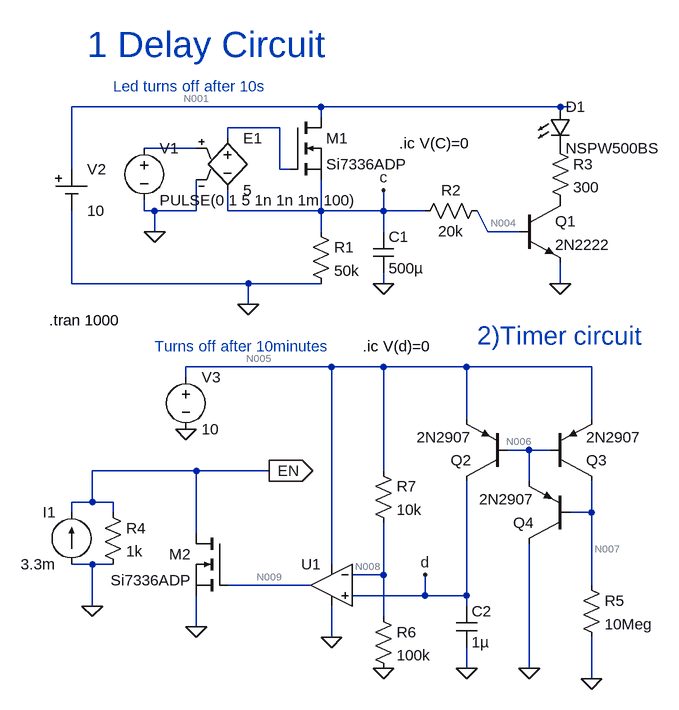
[diagram p0: schematic TimerDelay.asc]
TimerDelay.asc, the LTspice schematic file:
Version 4
SHEET 1 1604 680
WIRE 1072 -432 688 -432
WIRE 1440 -432 1072 -432
WIRE 1456 -432 1440 -432
WIRE 1072 -416 1072 -432
WIRE 1008 -400 928 -400
WIRE 928 -384 928 -400
WIRE 880 -368 800 -368
WIRE 688 -336 688 -432
WIRE 1008 -336 1008 -400
WIRE 1024 -336 1008 -336
WIRE 800 -272 800 -288
WIRE 816 -272 800 -272
WIRE 880 -272 880 -320
WIRE 880 -272 816 -272
WIRE 928 -272 928 -304
WIRE 1072 -272 1072 -320
WIRE 1072 -272 928 -272
WIRE 1168 -272 1168 -304
WIRE 1168 -272 1072 -272
WIRE 1232 -272 1168 -272
WIRE 816 -240 816 -272
WIRE 1072 -240 1072 -272
WIRE 1168 -240 1168 -272
WIRE 1328 -240 1312 -272
WIRE 1376 -240 1328 -240
WIRE 688 -160 688 -272
WIRE 960 -160 688 -160
WIRE 1072 -160 960 -160
WIRE 1168 -160 1168 -176
WIRE 1440 -160 1440 -192
WIRE 960 -128 960 -160
WIRE 1088 -32 864 -32
WIRE 1168 -32 1088 -32
WIRE 1296 -32 1168 -32
WIRE 1488 -32 1296 -32
WIRE 864 -16 864 -32
WIRE 1296 48 1296 -32
WIRE 1488 48 1488 -32
WIRE 1392 96 1360 96
WIRE 1424 96 1392 96
WIRE 880 128 720 128
WIRE 992 128 880 128
WIRE 1168 128 1168 -32
WIRE 1392 144 1392 96
WIRE 720 176 720 128
WIRE 720 176 688 176
WIRE 752 176 720 176
WIRE 688 192 688 176
WIRE 752 192 752 176
WIRE 1488 192 1488 144
WIRE 1488 192 1456 192
WIRE 880 224 880 128
WIRE 720 272 688 272
WIRE 752 272 720 272
WIRE 1088 272 1088 -32
WIRE 1168 288 1168 208
WIRE 1168 288 1120 288
WIRE 1056 304 928 304
WIRE 1488 304 1488 192
WIRE 1232 320 1232 288
WIRE 1232 320 1120 320
WIRE 1296 320 1296 144
WIRE 1296 320 1232 320
WIRE 720 336 720 272
WIRE 1296 336 1296 320
WIRE 1168 352 1168 288
WIRE 880 368 880 320
WIRE 1088 384 1088 336
WIRE 1296 432 1296 400
WIRE 1392 432 1392 240
WIRE 1488 448 1488 384
FLAG 960 -128 0
FLAG 1168 -160 0
FLAG 1440 -160 0
FLAG 816 -240 0
FLAG 1168 -304 c
FLAG 992 128 EN
IOPIN 992 128 Out
FLAG 880 368 0
FLAG 720 336 0
FLAG 864 64 0
FLAG 1088 384 0
FLAG 1488 448 0
FLAG 1296 432 0
FLAG 1168 432 0
FLAG 1232 288 d
FLAG 1392 432 0
SYMBOL nmos 1024 -416 R0
SYMATTR InstName M1
SYMATTR Value Si7336ADP
SYMBOL e 928 -400 R0
SYMATTR InstName E1
SYMATTR Value 5
SYMBOL voltage 800 -384 R0
WINDOW 123 0 0 Left 0
WINDOW 39 0 0 Left 0
SYMATTR InstName V1
SYMATTR Value PULSE(0 1 5 1n 1n 1m 100)
SYMBOL Misc\\cell 688 -336 R0
SYMATTR InstName V2
SYMATTR Value 10
SYMBOL res 1056 -256 R0
SYMATTR InstName R1
SYMATTR Value 50k
SYMBOL cap 1152 -240 R0
SYMATTR InstName C1
SYMATTR Value 500µ
SYMBOL res 1328 -288 R90
WINDOW 0 0 56 VBottom 2
WINDOW 3 32 56 VTop 2
SYMATTR InstName R2
SYMATTR Value 20k
SYMBOL npn 1376 -288 R0
SYMATTR InstName Q1
SYMATTR Value 2N2222
SYMBOL LED 1424 -432 R0
SYMATTR InstName D1
SYMATTR Value NSPW500BS
SYMATTR Description Diode
SYMATTR Type diode
SYMBOL res 1424 -384 R0
SYMATTR InstName R3
SYMATTR Value 300
SYMBOL nmos 928 224 M0
SYMATTR InstName M2
SYMATTR Value Si7336ADP
SYMBOL current 688 272 R180
WINDOW 0 24 80 Left 2
WINDOW 3 24 0 Left 2
SYMATTR InstName I1
SYMATTR Value 3.3m
SYMBOL res 736 176 R0
SYMATTR InstName R4
SYMATTR Value 1k
SYMBOL voltage 864 -32 R0
SYMATTR InstName V3
SYMATTR Value 10
SYMBOL OpAmps\\UniversalOpamp2 1088 304 M0
SYMATTR InstName U1
SYMBOL cap 1280 336 R0
SYMATTR InstName C2
SYMATTR Value 1µ
SYMBOL res 1472 288 R0
SYMATTR InstName R5
SYMATTR Value 10Meg
SYMBOL pnp 1360 144 R180
SYMATTR InstName Q2
SYMATTR Value 2N2907
SYMBOL pnp 1424 144 M180
SYMATTR InstName Q3
SYMATTR Value 2N2907
SYMBOL res 1152 336 R0
SYMATTR InstName R6
SYMATTR Value 100k
SYMBOL res 1152 112 R0
SYMATTR InstName R7
SYMATTR Value 10k
SYMBOL pnp 1456 240 R180
SYMATTR InstName Q4
SYMATTR Value 2N2907
TEXT 712 -528 Left 5 ;1 Delay Circuit
TEXT 752 -464 Left 2 ;Led turns off after 10s
TEXT 654 -104 Left 2 !.tran 1000
TEXT 1192 -376 Left 2 !.ic V(C)=0
TEXT 1136 -64 Left 2 !.ic V(d)=0
TEXT 816 -64 Left 2 ;Turns off after 10minutes
TEXT 1312 -80 Left 4 ;2)Timer circuit

The netlist it stands for:
* TimerDelay.asc
M1 N001 N002 c c Si7336ADP
E1 N002 c N003 0 5
V1 N003 0 PULSE(0 1 5 1n 1n 1m 100)
V2 N001 0 10
R1 c 0 50k
C1 c 0 500µ
R2 N004 c 20k
Q1 P001 N004 0 0 2N2222
D1 N001 P002 NSPW500BS
R3 P002 P001 300
M2 EN N009 0 0 Si7336ADP
I1 0 EN 3.3m
R4 EN 0 1k
V3 N005 0 10
XU1 d N008 N005 0 N009 level.2 Avol=1Meg GBW=10Meg Slew=10Meg ilimit=25m rail=0 Vos=0 phimargin=45 en=0 enk=0 in=0 ink=0 Rin=500Meg  ; pins IN+ IN- V+ V- OUT
C2 d 0 1µ
R5 N007 0 10Meg
Q2 d N006 N005 0 2N2907
Q3 N007 N006 N005 0 2N2907
R6 N008 0 100k
R7 N005 N008 10k
Q4 0 N007 N006 0 2N2907
.model D D
.lib standard.dio
.model NPN NPN
.model PNP PNP
.lib standard.bjt
.model NMOS NMOS
.model PMOS PMOS
.lib standard.mos
* 1 Delay Circuit
* Led turns off after 10s
.tran 1000
.ic V(C)=0
.ic V(d)=0
* Turns off after 10minutes
* 2)Timer circuit
.lib UniversalOpamps2.sub
.backanno
.end

* Results of the author's LTspice run, read from the files saved beside the schematic
* Operating Point, zero values left out:
*   V(n001) = 10 V
*   V(n004) = 199.9 nV
*   V(p001) = 9.994 V
*   V(p002) = 9.994 V
*   V(en) = 3.3 V
*   V(n009) = 10.73 µV
*   V(n005) = 10 V
*   V(n008) = 9.091 V
*   V(n007) = 9.179 V
*   V(n006) = 9.526 V
*   Ic(Q1) = 10.01 pA
*   Ib(Q1) = -9.997 pA
*   Ic(Q2) = -987.9 nA
*   Ib(Q2) = -3.652 nA
*   Ie(Q2) = 991.5 nA
*   Ic(Q3) = -917.8 nA
*   Ib(Q3) = -3.661 nA
*   Ie(Q3) = 921.5 nA
*   Ic(Q4) = -7.294 nA
*   Ib(Q4) = -18.24 pA
*   Ie(Q4) = 7.313 nA
*   Id(M1) = 15.4 pA
*   Is(M1) = -15.4 pA
*   Id(M2) = 8.438 pA
*   Is(M2) = -8.438 pA
*   I(D1) = 10.01 pA
*   I(I1) = 3.3 mA
*   I(R2) = 9.997 pA
*   I(R3) = 10.01 pA
*   I(R4) = 3.3 mA
*   I(R5) = 917.9 nA
*   I(R6) = 90.91 µA
*   I(R7) = 90.92 µA
*   I(V2) = -36.38 pA
*   I(V3) = -93.99 µA
*   Ix(u1:1) = -10 nA
*   Ix(u1:2) = 8.182 nA
*   Ix(u1:3) = 1.159 µA
*   Ix(u1:4) = -982.2 nA
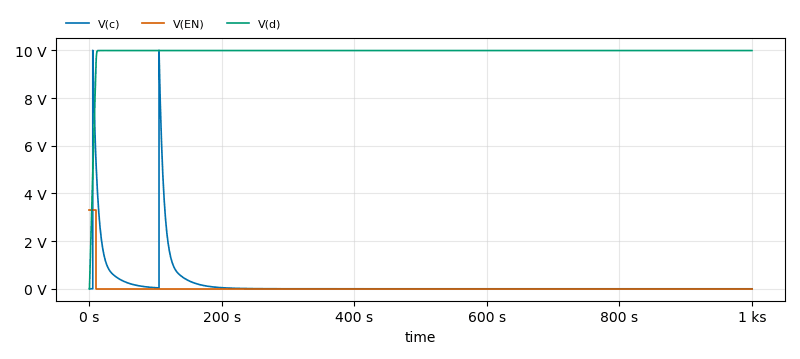
[diagram p1: Transient Analysis of TimerDelay.asc, plotted from the saved traces]
* Transient Analysis, 1 run:
*   V(c): min 0 V, max 10 V, average 194.8 mV, rms 905.4 mV, last 1.75 µV
*   V(EN): min 7.474 µV, max 3.306 V, average 31.47 mV, rms 322.2 mV, last 7.474 µV
*   V(d): min 0 V, max 9.993 V, average 9.94 V, rms 9.958 V, last 9.992 V